# Altium schematic sheet Peripheral.SchDoc
size 297 x 209 mm
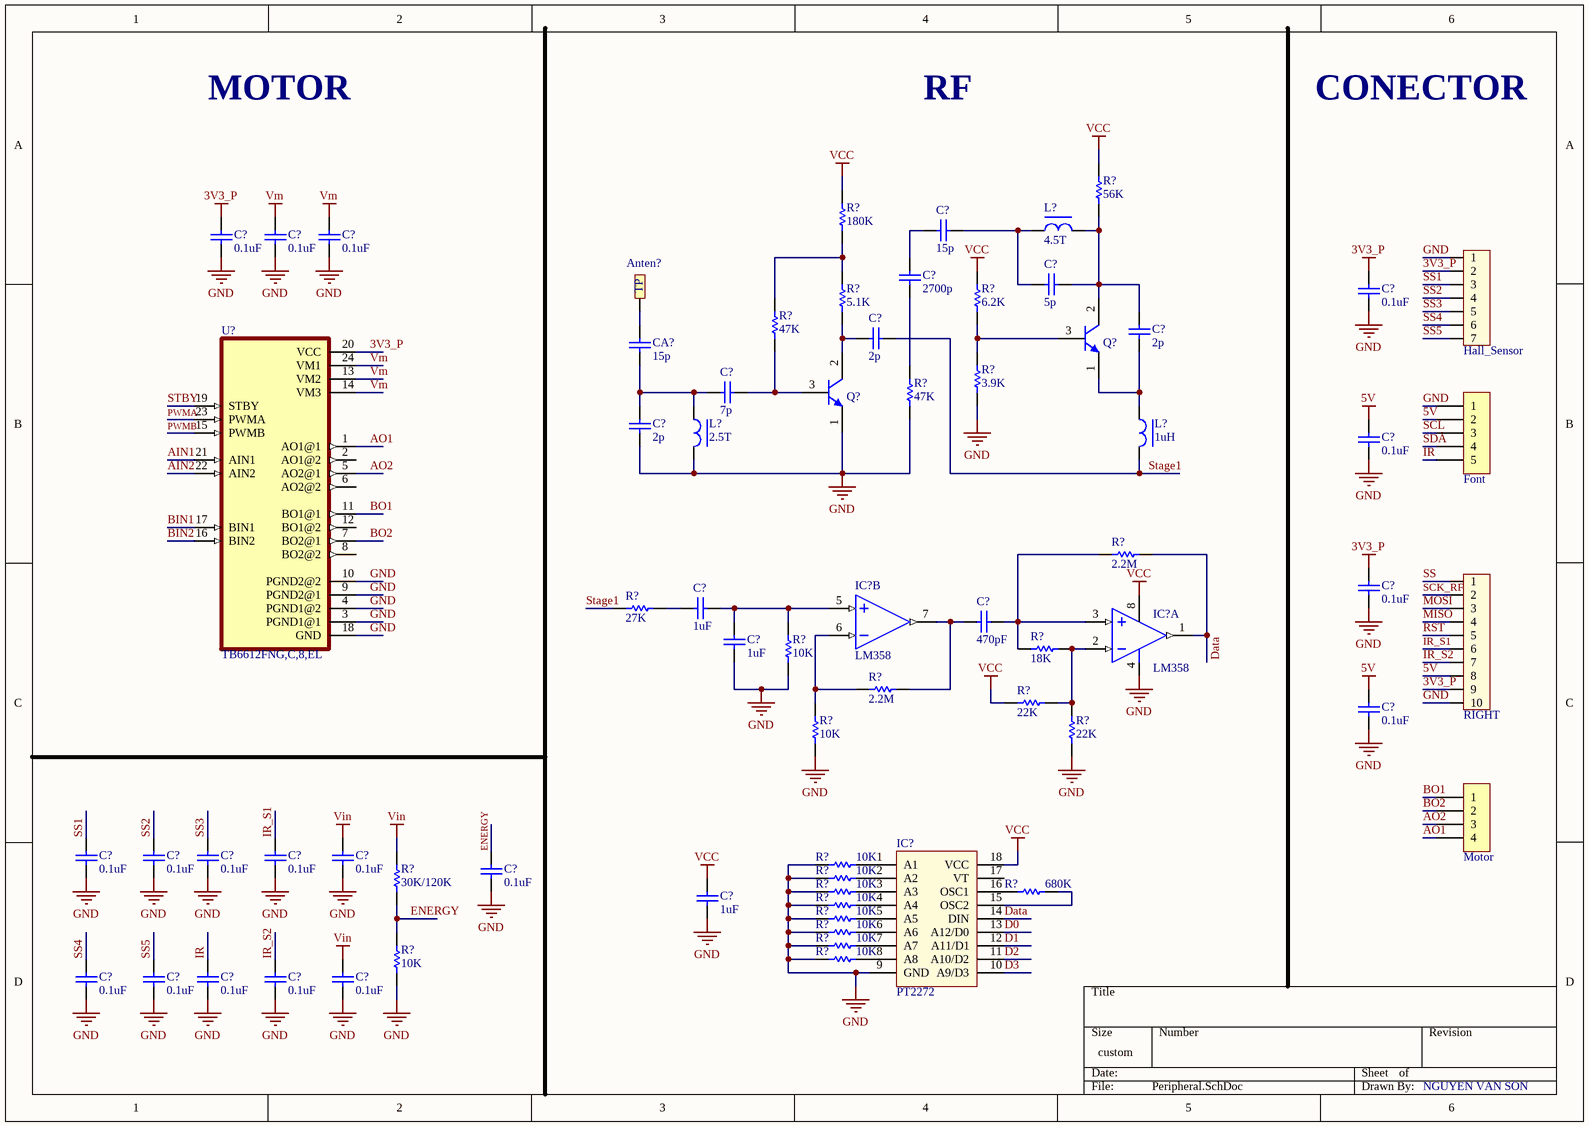
[diagram p0: Peripheral.SchDoc]

## Parts
(Parts that share a designator on the sheet are numbered #1, #2 ... from top to bottom, then left to right.)
Anten?  Test Point  [TP]  (value not drawn)
C?#1  value 0.1uF  [CAP-SM-0805]  (hidden comment: Cap Non-Pol SMD)
C?#2  value 0.1uF  [CAP-SM-0805]  (hidden comment: Cap Non-Pol SMD)
C?#3  value 0.1uF  [CAP-SM-0805]  (hidden comment: Cap Non-Pol SMD)
C?#4  value 15p  [CAP-SM-0603]  (hidden comment: Cap Non-Pol SMD)
C?#5  value 2700p  [CAP-SM-0603]  (hidden comment: Cap Non-Pol SMD)
C?#6  value 5p  [CAP-SM-0603]  (hidden comment: Cap Non-Pol SMD)
C?#7  value 0.1uF  [CAP-SM-0805]  (hidden comment: Cap Non-Pol SMD)
C?#8  value 2p  [CAP-SM-0603]  (hidden comment: Cap Non-Pol SMD)
C?#9  value 2p  [CAP-SM-0603]  (hidden comment: Cap Non-Pol SMD)
C?#10  value 7p  [CAP-SM-0805]  (hidden comment: Cap Non-Pol SMD)
C?#11  value 2p  [CAP-SM-0603]  (hidden comment: Cap Non-Pol SMD)
C?#12  value 0.1uF  [CAP-SM-0805]  (hidden comment: Cap Non-Pol SMD)
C?#13  value 0.1uF  [CAP-SM-0805]  (hidden comment: Cap Non-Pol SMD)
C?#14  value 1uF  [CAP-SM-0603]  (hidden comment: Cap Non-Pol SMD)
C?#15  value 1uF  [CAP-SM-0603]  (hidden comment: Cap Non-Pol SMD)
C?#16  value 470pF  [CAP-SM-0603]  (hidden comment: Cap Non-Pol SMD)
C?#17  value 0.1uF  [CAP-SM-0805]  (hidden comment: Cap Non-Pol SMD)
C?#18  value 0.1uF  [CAP-SM-0805]  (hidden comment: Cap Non-Pol SMD)
C?#19  value 0.1uF  [CAP-SM-0805]  (hidden comment: Cap Non-Pol SMD)
C?#20  value 0.1uF  [CAP-SM-0805]  (hidden comment: Cap Non-Pol SMD)
C?#21  value 0.1uF  [CAP-SM-0805]  (hidden comment: Cap Non-Pol SMD)
C?#22  value 0.1uF  [CAP-SM-0805]  (hidden comment: Cap Non-Pol SMD)
C?#23  value 0.1uF  [CAP-SM-0805]  (hidden comment: Cap Non-Pol SMD)
C?#24  value 1uF  [CAP-SM-0603]  (hidden comment: Cap Non-Pol SMD)
C?#25  value 0.1uF  [CAP-SM-0805]  (hidden comment: Cap Non-Pol SMD)
C?#26  value 0.1uF  [CAP-SM-0805]  (hidden comment: Cap Non-Pol SMD)
C?#27  value 0.1uF  [CAP-SM-0805]  (hidden comment: Cap Non-Pol SMD)
C?#28  value 0.1uF  [CAP-SM-0805]  (hidden comment: Cap Non-Pol SMD)
C?#29  value 0.1uF  [CAP-SM-0805]  (hidden comment: Cap Non-Pol SMD)
CA?  value 15p  [CAP-SM-0603]  (hidden comment: Cap Non-Pol SMD)
H300  Hall_Sensor  [Header 7P DC 2.54]
H301  Font  [Header 5P DC 2.54]
H302  RIGHT  [XH2.54M-10]
H303  Motor  [JP 1x4 DT]
IC?#1  LM358  [DIP8]  (part B of 2)
IC?#2  LM358  [DIP8]  (part A of 2)
IC?#3  PT2272  [DIP18]
L?#1  4.5T  [L-DIP-M-5.3]
L?#2  2.5T  [L-DIP-M-5.3]
L?#3  1uH  [RES-1/4W-SMALL]
Q?#1  C1815  [SOT23B]  (value not drawn)
Q?#2  C1815  [SOT23B]  (value not drawn)
R?#1  value 56K  [RES-SM-0603]  (hidden comment: RESISTOR SMD)
R?#2  value 180K  [RES-SM-0603]  (hidden comment: RESISTOR SMD)
R?#3  value 5.1K  [RES-SM-0805]  (hidden comment: RESISTOR SMD)
R?#4  value 6.2K  [RES-SM-0805]  (hidden comment: RESISTOR SMD)
R?#5  value 47K  [RES-SM-0603]  (hidden comment: RESISTOR SMD)
R?#6  value 3.9K  [RES-SM-0805]  (hidden comment: RESISTOR SMD)
R?#7  value 47K  [RES-SM-0603]  (hidden comment: RESISTOR SMD)
R?#8  value 2.2M  [RES-SM-0603]  (hidden comment: RESISTOR SMD)
R?#9  value 27K  [RES-SM-0603]  (hidden comment: RESISTOR SMD)
R?#10  value 10K  [RES-SM-0603]  (hidden comment: RESISTOR SMD)
R?#11  value 18K  [RES-SM-0603]  (hidden comment: RESISTOR SMD)
R?#12  value 2.2M  [RES-SM-0603]  (hidden comment: RESISTOR SMD)
R?#13  value 10K  [RES-SM-0603]  (hidden comment: RESISTOR SMD)
R?#14  value 22K  [RES-SM-0603]  (hidden comment: RESISTOR SMD)
R?#15  R?: 22K  [RES-SM-0603]  (hidden comment: RESISTOR SMD)
R?#16  value 10K  [RES-SM-0603]  (hidden comment: RESISTOR SMD)
R?#17  value 680K  [RES-SM-0805]  (hidden comment: RESISTOR SMD)
R?#18  value 30K/120K  [RES-SM-0805]  (hidden comment: RESISTOR SMD)
R?#19  value 10K  [RES-SM-0603]  (hidden comment: RESISTOR SMD)
R?#20  value 10K  [RES-SM-0603]  (hidden comment: RESISTOR SMD)
R?#21  value 10K  [RES-SM-0603]  (hidden comment: RESISTOR SMD)
R?#22  value 10K  [RES-SM-0603]  (hidden comment: RESISTOR SMD)
R?#23  value 10K  [RES-SM-0603]  (hidden comment: RESISTOR SMD)
R?#24  value 10K  [RES-SM-0603]  (hidden comment: RESISTOR SMD)
R?#25  value 10K  [RES-SM-0805]  (hidden comment: RESISTOR SMD)
R?#26  value 10K  [RES-SM-0603]  (hidden comment: RESISTOR SMD)
U?  TB6612FNG,C,8,EL  [SOP65P760X160-24N]

## Nets
3V3_P: C?#1.2 C?#7.2 C?#13.2 H300.2 H302.9 U?.20(VCC)
5V: C?#12.2 C?#17.2 H301.2 H302.8
GND: C?#1.1 C?#2.1 C?#3.1 C?#7.1 C?#11.1 C?#12.1 C?#13.1 C?#15.2 C?#17.1 C?#18.1 C?#19.1 C?#20.1 C?#21.1 C?#22.1 C?#23.1 C?#24.1 C?#25.1 C?#26.1 C?#27.1 C?#28.1 C?#29.1 H300.1 H301.1 H302.10 IC?#2.4(-V) IC?#3.9(GND) L?#2.2 Q?#2.1(E) R?#6.2 R?#7.2 R?#10.2 R?#13.2 R?#15.2 R?#16.2 R?#19.2 R?#20.2 R?#21.2 R?#22.2 R?#23.2 R?#24.2 R?#25.1 R?#26.2 U?.3(PGND1@1) U?.4(PGND1@2) U?.9(PGND2@1) U?.10(PGND2@2) U?.18(GND)
VCC: C?#24.2 IC?#2.8(+V) IC?#3.18(VCC) R?#1.1 R?#2.1 R?#4.1 R?#14.2
Vin: C?#22.2 C?#29.2 R?#18.2
Vm: C?#2.2 C?#3.2 U?.13(VM2) U?.14(VM3) U?.24(VM1)
AIN1: U?.21(AIN1)
AIN2: U?.22(AIN2)
AO1: H303.4 U?.1(AO1@1)
AO2: H303.3 U?.5(AO2@1)
BIN1: U?.17(BIN1)
BIN2: U?.16(BIN2)
BO1: H303.1 U?.11(BO1@1)
BO2: H303.2 U?.7(BO2@1)
D0: IC?#3.13(A12/D0)
D1: IC?#3.12(A11/D1)
D2: IC?#3.11(A10/D2)
D3: IC?#3.10(A9/D3)
Data: IC?#2.1(OUT) IC?#3.14(DIN) R?#8.2
ENERGY: C?#23.2 R?#18.1 R?#25.2
IR: C?#27.2 H301.5
IR_S1: C?#21.2 H302.6
IR_S2: C?#28.2 H302.7
MISO: H302.4
MOSI: H302.3
PWMA: U?.23(PWMA)
PWMB: U?.15(PWMB)
RST: H302.5
SCK_RF: H302.2
SCL: H301.3
SDA: H301.4
SS: H302.1
SS1: C?#18.2 H300.3
SS2: C?#19.2 H300.4
SS3: C?#20.2 H300.5
SS4: C?#25.2 H300.6
SS5: C?#26.2 H300.7
Stage1: C?#9.1 L?#3.2 R?#9.2
STBY: U?.19(STBY)
NetAnten?_TP1: Anten?.TP1 CA?.1
NetC?#4_1: C?#4.1 C?#6.2 L?#1.1
NetC?#4_2: C?#4.2 C?#5.1
NetC?#5_2: C?#5.2 R?#7.1
NetC?#6_1: C?#6.1 C?#8.1 L?#1.2 Q?#1.2(C) R?#1.2
NetC?#8_2: C?#8.2 L?#3.1 Q?#1.1(E)
NetC?#9_2: C?#9.2 Q?#2.2(C) R?#3.2
NetC?#10_1: C?#10.1 Q?#2.3(B) R?#5.2
NetC?#10_2: C?#10.2 C?#11.2 CA?.2 L?#2.1
NetC?#14_1: C?#14.1 C?#15.1 IC?#1.5(IN+) R?#10.1
NetC?#14_2: C?#14.2 R?#9.1
NetC?#16_1: C?#16.1 IC?#2.3(IN+) R?#8.1 R?#11.2
NetC?#16_2: C?#16.2 IC?#1.7(OUT) R?#12.2
NetIC?#1_6: IC?#1.6(IN-) R?#12.1 R?#13.1
NetIC?#2_2: IC?#2.2(IN-) R?#11.1 R?#14.1 R?#15.1
NetIC?#3_1: IC?#3.1(A1) R?#16.1
NetIC?#3_2: IC?#3.2(A2) R?#19.1
NetIC?#3_3: IC?#3.3(A3) R?#20.1
NetIC?#3_4: IC?#3.4(A4) R?#21.1
NetIC?#3_5: IC?#3.5(A5) R?#22.1
NetIC?#3_6: IC?#3.6(A6) R?#23.1
NetIC?#3_7: IC?#3.7(A7) R?#24.1
NetIC?#3_8: IC?#3.8(A8) R?#26.1
NetIC?#3_15: IC?#3.15(OSC2) R?#17.2
NetIC?#3_16: IC?#3.16(OSC1) R?#17.1
NetQ?#1_3: Q?#1.3(B) R?#4.2 R?#6.1
NetR?#2_2: R?#2.2 R?#3.1 R?#5.1

Not connected (* = marked no-connect by the designer): IC?#3 17(VT); U? 2(AO1@2) 6(AO2@2) 8(BO2@2) 12(BO1@2)

## Notes on the sheet
- MOTOR
- RF
- CONECTOR
- NGUYEN VAN SON
- (in symbol Test Point) TP

## Library data of the parts
C?#1-C?#29 CA? = Cap Non-Pol SMD: Capacitor
H300 = Header 7P 2.54 Duc Cong: Cắm; Ten_Linh_Kien: Header 7P XH2.54-7P Đực Cong; Don_Vi: Con; Ma_Hang: MH004118; Chung_Loai: Cắm
H301 = Header 5P 2.54 Duc Cong: Cắm; Ten_Linh_Kien: Header 5P XH2.54-5P Đực Cong; Don_Vi: Con; Ma_Hang: MH001308; Chung_Loai: Cắm
H302 = Header 10P 2.54 Duc Thang: Cắm; Ten_Linh_Kien: Header 10P XH2.54-10P Đực Thẳng; Don_Vi: Con; Ma_Hang: MH001286; Chung_Loai: Cắm
H303 = Header 4P 2.54 Duc Cong: Cắm; Ten_Linh_Kien: Header 4P XH2.54-4P Đực Cong; Don_Vi: Con; Ma_Hang: MH001310; Chung_Loai: Cắm
IC?#1 IC?#2 = LM358: Low-Power Dual Operational Amplifier; Value: LM358
IC?#3 = PT2272: Remote Control Decoder
L?#1-L?#3 = L-DIP-1: Inductor; Value: 150 mH
Q?#1 Q?#2 = C1815: NPN Bipolar Transistor
R?#1-R?#26 = RESISTOR SMD: Resistor
U? = TB6612FNG,C,8,EL: - Motor Driver Power MOSFET Parallel 24-SSOP; MF: Toshiba; SnapEDA_Link: https://www.snapeda.com/parts/TB6612FNG,C,8,EL/Toshiba+Semiconductor+and+Storage/view-part/?ref=snap; Package: SSOP-24 Toshiba; MP: TB6612FNG,C,8,EL; Check_prices: https://www.snapeda.com/parts/TB6612FNG,C,8,EL/Toshiba+Semiconductor+and+Storage/view-part/?ref=eda; Purchase-URL: https://pricing.snapeda.com/search/part/TB6612FNG,C,8,EL/?ref=eda; Price: None; Value: *; Availability: In Stock